# EAGLE design yetis_lsb_v1.7.2 (EAGLE 6.4)
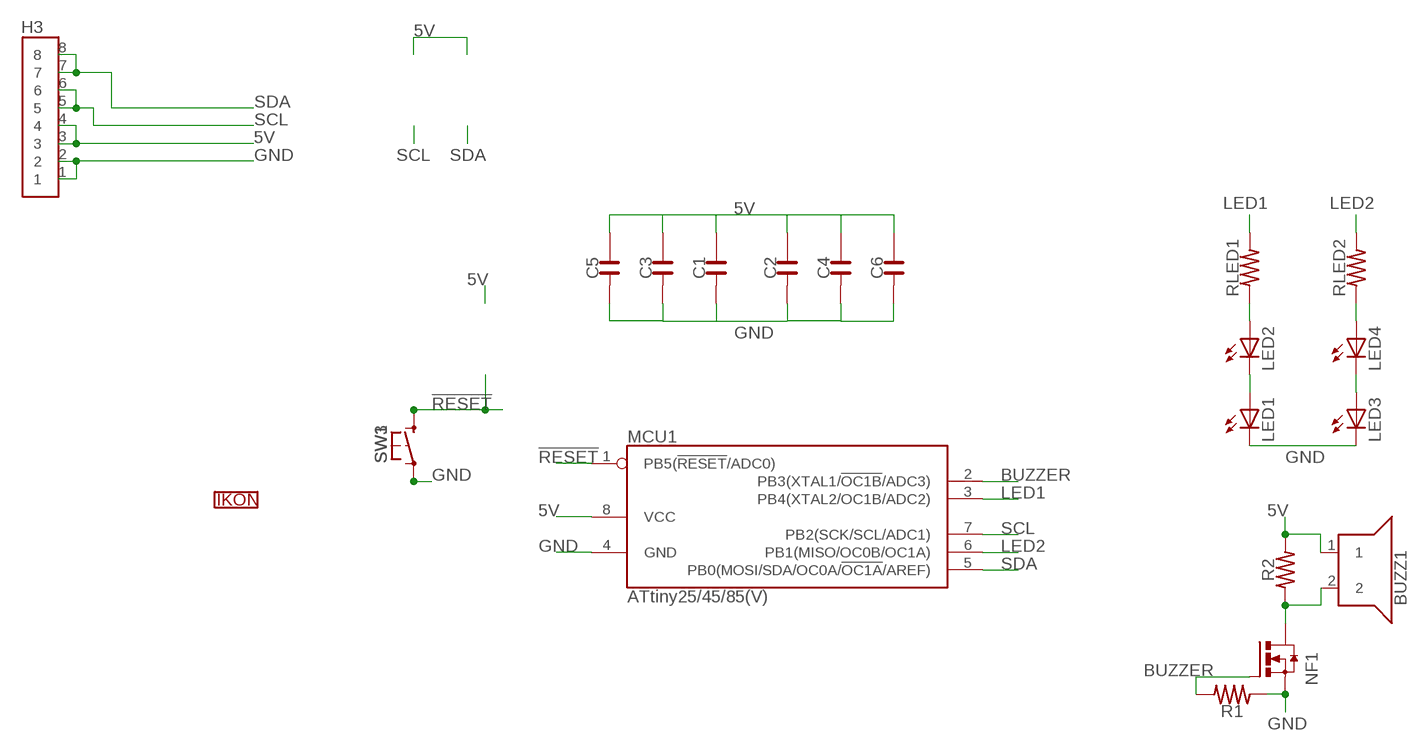
[diagram p0: schematic, sheet 1]

## Parts
BUZZ1  BUZZER-PS1240P02BT  [BUZZ_PS1240P02BT]
C1  CAPACITOR-1206  [1206_YAGEO]
C2  CAPACITOR-1206  [1206_YAGEO]
C3  CAPACITOR-0805  [0805_YAGEO]
C4  CAPACITOR-0805  [0805_YAGEO]
C5  CAPACITOR-0603  [0603_YAGEO]
C6  CAPACITOR-0603  [0603_YAGEO]
H3  HEADER_8P-0.1"_2X4-SMD-SULLINS  [HEADER-0.1"_2X4-SMD-SULLINS]
LED1  LED-7.62MM-PTH  [7.6MM_LED_PTH]
LED2  LED-7.62MM-PTH  [7.6MM_LED_PTH]
LED3  LED-7.62MM-PTH  [7.6MM_LED_PTH]
LED4  LED-7.62MM-PTH  [7.6MM_LED_PTH]
MCU1  ATMEL_ATTINY25/45/85(V)-SOIC_DUAL  [SOIC-8_DUAL]
NF1  FET_N-CH-SOT-23-3-LITTLEFOOT  [SOT-23-3-LITTLEFOOT]
R1  RESISTOR-0603  [0603_YAGEO]
R2  RESISTOR-0603  [0603_YAGEO]
RLED1  RESISTOR-0603  [0603_YAGEO]
RLED2  RESISTOR-0603  [0603_YAGEO]
SW1  SWITCH_SPST-KMT0  [SWITCH_KMT0]
SW3  SWITCH_SPST-TL3315  [SWITCH_TL3315]
U$11  IKONLEARNING-20MIL  [IKON_LEARNING_20MIL]

## Nets
5V: BUZZ1.1 C1.2 C2.2 C3.2 C4.2 C5.2 C6.2 H3.3 H3.4 MCU1.8(VCC) R2.2
!RESET: MCU1.1(PB5(!RESET!/ADC0)) SW1.1@1 SW1.1@2 SW3.1@1 SW3.1@2
BUZZER: MCU1.2(PB3(XTAL1/!OC1B!/ADC3)) NF1.G R1.2
GND: C1.1 C2.1 C3.1 C4.1 C5.1 C6.1 H3.1 H3.2 LED1.1(C) LED1.2(C) LED3.1(C) LED3.2(C) MCU1.4(GND) NF1.S@0(S) R1.1 SW1.2@1 SW1.2@2 SW3.2@1 SW3.2@2
LED1: MCU1.3(PB4(XTAL2/OC1B/ADC2)) RLED1.2
LED2: MCU1.6(PB1(MISO/OC0B/OC1A)) RLED2.2
N$1: LED2.3(A) LED2.4(A) RLED1.1
N$2: LED1.3(A) LED1.4(A) LED2.1(C) LED2.2(C)
N$3: LED4.3(A) LED4.4(A) RLED2.1
N$4: LED3.3(A) LED3.4(A) LED4.1(C) LED4.2(C)
N$12: BUZZ1.2 NF1.D@0(D) R2.1
SCL: H3.5 H3.6 MCU1.7(PB2(SCK/SCL/ADC1))
SDA: H3.7 H3.8 MCU1.5(PB0(MOSI/SDA/OC0A/!OC1A!/AREF))

## Library data of the parts
BUZZ1 = NaN:BUZZER
C1-C6 = NaN:CAPACITOR
H3 = NaN:HEADER_8P
LED1-LED4 = NaN:LED: LEDs
MCU1 = NaN:ATMEL_ATTINY25/45/85(V)
NF1 = NaN:FET_N-CH
R1 R2 RLED1 RLED2 = NaN:RESISTOR
SW1 SW3 = NaN:SWITCH_SPST
U$11 = NaN:IKON

## Board
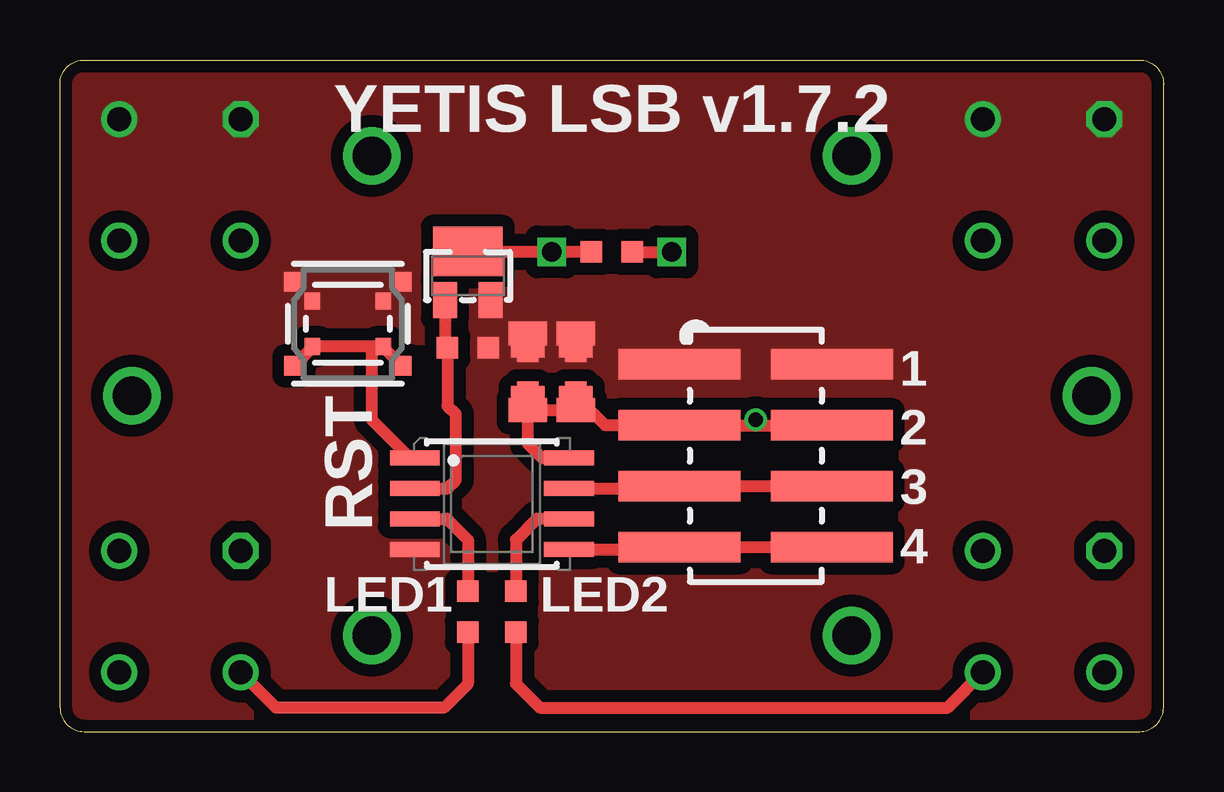
[diagram p1: board, top side]
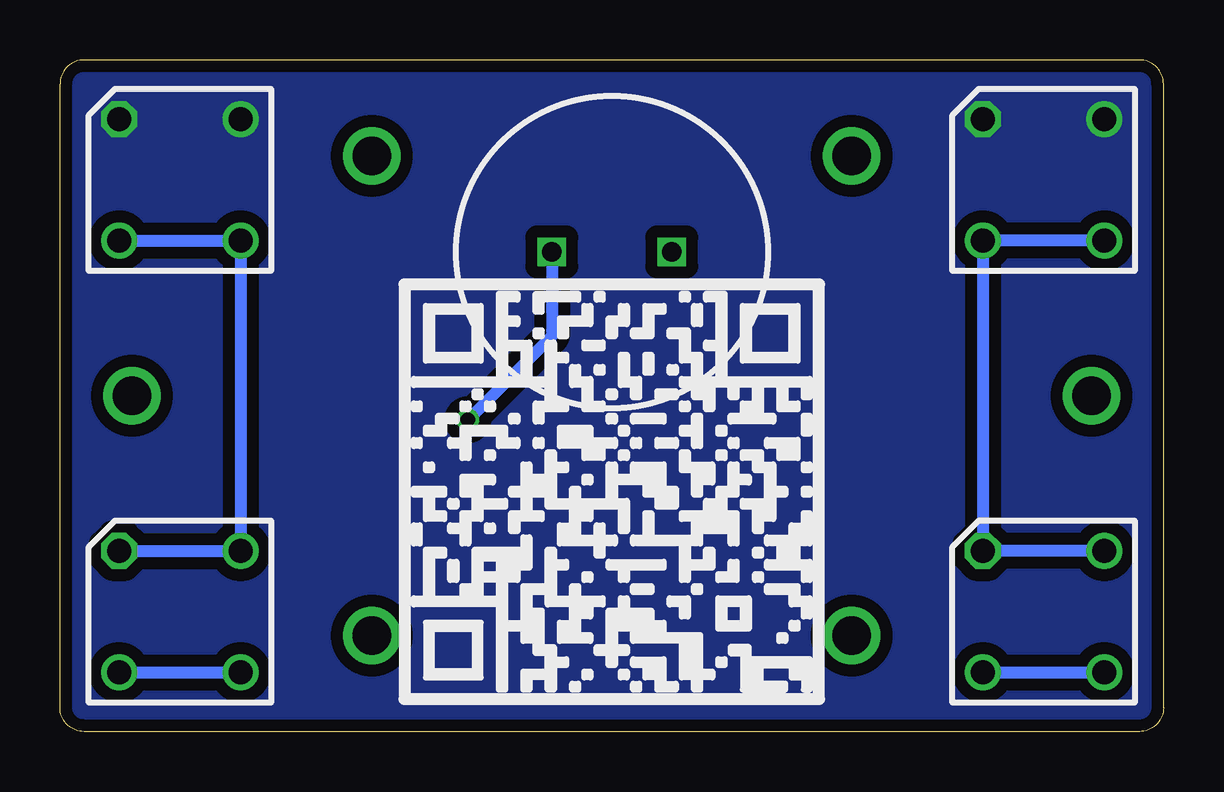
[diagram p2: board, bottom side, seen from below]

Size 46 x 28 mm. Coordinates in mm from the lower left corner, seen from the top.
Outline: 0,1 0,27 arc-90 1,28 45,28 arc-90 46,27 46,1 arc-90 45,0 1,0 arc-90 0,1
Copper layers (1*16): Top 0.0356mm / dielectric 1.5011mm / Bottom 0.0356mm
Design rules "LaenPCBOrder_mod": minimum track width 6mil, minimum drill 13mil, track to track 6mil, track to pad 6mil, pad to pad 6mil, via to via 6mil, smd to smd 0mil, copper to edge 15mil, drill to drill 6mil, minimum pad ring 7mil, minimum via ring 7mil, stop-mask expansion 4mil, vias tented up to drill 75mil, thermal gap 10mil

### Footprints (pad centres in the part's own frame; a part is rotated, then mirrored left to right if it is on the bottom)
BUZZ_PS1240P02BT = drill 0.8 square: 1 -2.5,0; 2 2.5,0
1206_YAGEO = smd 1.6 x 1: 1 0,1.6; 2 0,-1.6
0805_YAGEO = smd 1.4 x 0.9: 1 0,1.05; 2 0,-1.05
0603_YAGEO = smd 0.9 x 0.9: 1 0,0.85; 2 0,-0.85
HEADER-0.1"_2X4-SMD-SULLINS = smd 1.27 x 5.08: 1 -3.81,-3.175; 2 -3.81,3.175; 3 -1.27,-3.175; 4 -1.27,3.175; 5 1.27,-3.175; 6 1.27,3.175; 7 3.81,-3.175; 8 3.81,3.175
7.6MM_LED_PTH = drill 1 octagon: 1 -2.54,2.54 | drill 1: 2 2.54,2.54; 3 2.54,-2.54; 4 -2.54,-2.54
SOIC-8_DUAL = smd 2.075 x 0.61: 1 -3.212,1.905; 2 -3.212,0.635; 3 -3.212,-0.635; 4 -3.212,-1.905; 5 3.212,-1.905; 6 3.212,-0.635; 7 3.212,0.635; 8 3.212,1.905
SOT-23-3-LITTLEFOOT = smd 2.9 x 2.05: D@0 0,1.025 | smd 1 x 1.5: G -0.95,-1; S@0 0.95,-1
SWITCH_KMT0 = smd 0.65 x 0.7: 1@1 -1.475,0.95; 1@2 1.475,0.95; 2@1 -1.475,-0.95; 2@2 1.475,-0.95
SWITCH_TL3315 = smd 0.8 x 0.8: 1@1 -2.25,1.75; 1@2 2.25,1.75; 2@1 -2.25,-1.75; 2@2 2.25,-1.75

### Placement (x,y rotation side)
BUZZ1  23,20 0 bottom
C1  21.5,15 0 top
C2  19.5,15 0 top
C3  21.5,15 0 top
C4  19.5,15 0 top
C5  21.5,15 0 top
C6  19.5,15 0 top
H3  29,11.5 270 top
LED1  5,23 0 bottom
LED2  5,5 0 bottom
LED3  41,23 0 bottom
LED4  41,5 0 bottom
MCU1  18,9.5 0 top
NF1  17,19 0 top
R1  17,16 270 top
R2  23,20 90 top
RLED1  17,5 180 top
RLED2  19,5 180 top
SW1  12,17 180 top
SW3  12,17 180 top
U$11  23,10 0 bottom

### Tracks (layer width: path | path; a pad name or v marks a point on that pad's centre or on a via)
5V  (via drill 0.6)
  Top 0.5: C2.2 C1.2 | C2.2 C4.2 C6.2 | C5.2 C3.2 C1.2 | 19.4,13.5 C2.2 | 19.25,13.65 C2.2 | MCU1.8 20.09,11.4 19.5,12 C2.2 | 29,12.77 H3.3 22.73,12.77 22,13.5 21.6,13.5 C1.2 | 29,12.77 H3.4 | v29,13 29,12.77 | R2.2 BUZZ1.1
  Bottom 0.5: BUZZ1.1 25.5,16.5 v29,13
!RESET
  Top 0.5: SW1.1@1 SW1.1@2 10.53,16.02 SW3.1@2 | SW1.1@1 13.43,16 13,16 13,13 14.6,11.4 MCU1.1 | SW1.1@1 13.47,16.02 SW3.1@1
BUZZER
  Top 0.5: MCU1.2 16.14,10.13 16.5,10.5 16.5,13.23 16.15,13.58 R1.2 16.05,16.1 NF1.G
GND
  pour Top (isolate 0.5, rank 6, no thermals): 0,0 0,28 46,28 46,0
  pour Bottom (isolate 0.5, rank 6, no thermals): 0,0 0,28 46,28 46,0
LED1
  Top 0.5: MCU1.3 16.14,8.87 17,8 RLED1.2
LED2
  Top 0.5: MCU1.6 19.86,8.87 19,8 RLED2.2
N$1
  Top 0.5: RLED1.1 17,2 16,1 9,1 LED2.4
  Bottom 0.5: LED2.4 LED2.3
N$2
  Bottom 0.5: LED2.2 LED2.1 LED1.4 LED1.3
N$3
  Top 0.5: RLED2.1 19,2 20,1 37,1 LED4.3
  Bottom 0.5: LED4.4 LED4.3
N$4
  Bottom 0.5: LED4.1 39,7.54 | 39,7.54 LED4.2 | 39,7.54 38.46,8.08 LED3.3 LED3.4
N$5  (via drill 1.6)
  other vias: 43,14
N$6  (via drill 1.6)
  other vias: 3,14
N$7  (via drill 1.6)
  other vias: 13,24
N$8  (via drill 1.6)
  other vias: 33,24
N$9  (via drill 1.6)
  other vias: 13,4
N$10  (via drill 1.6)
  other vias: 33,4
N$12
  Top 0.5: NF1.D@0 17.02,20 BUZZ1.2 R2.1
SCL
  Top 0.5: H3.6 H3.5 25.73,10.13 MCU1.7
SDA
  Top 0.5: H3.8 H3.7 25.73,7.59 MCU1.5

### Text on the board
tPlace: YETIS LSB v1.7.2 | 1)GND | 2)VCC | RST | 3)SCL/DAT | 4)SDA | 1 / 2 / 3 / 4 | LED1 | LED2